# EAGLE design poesp_1.1 (EAGLE 7.7.0)
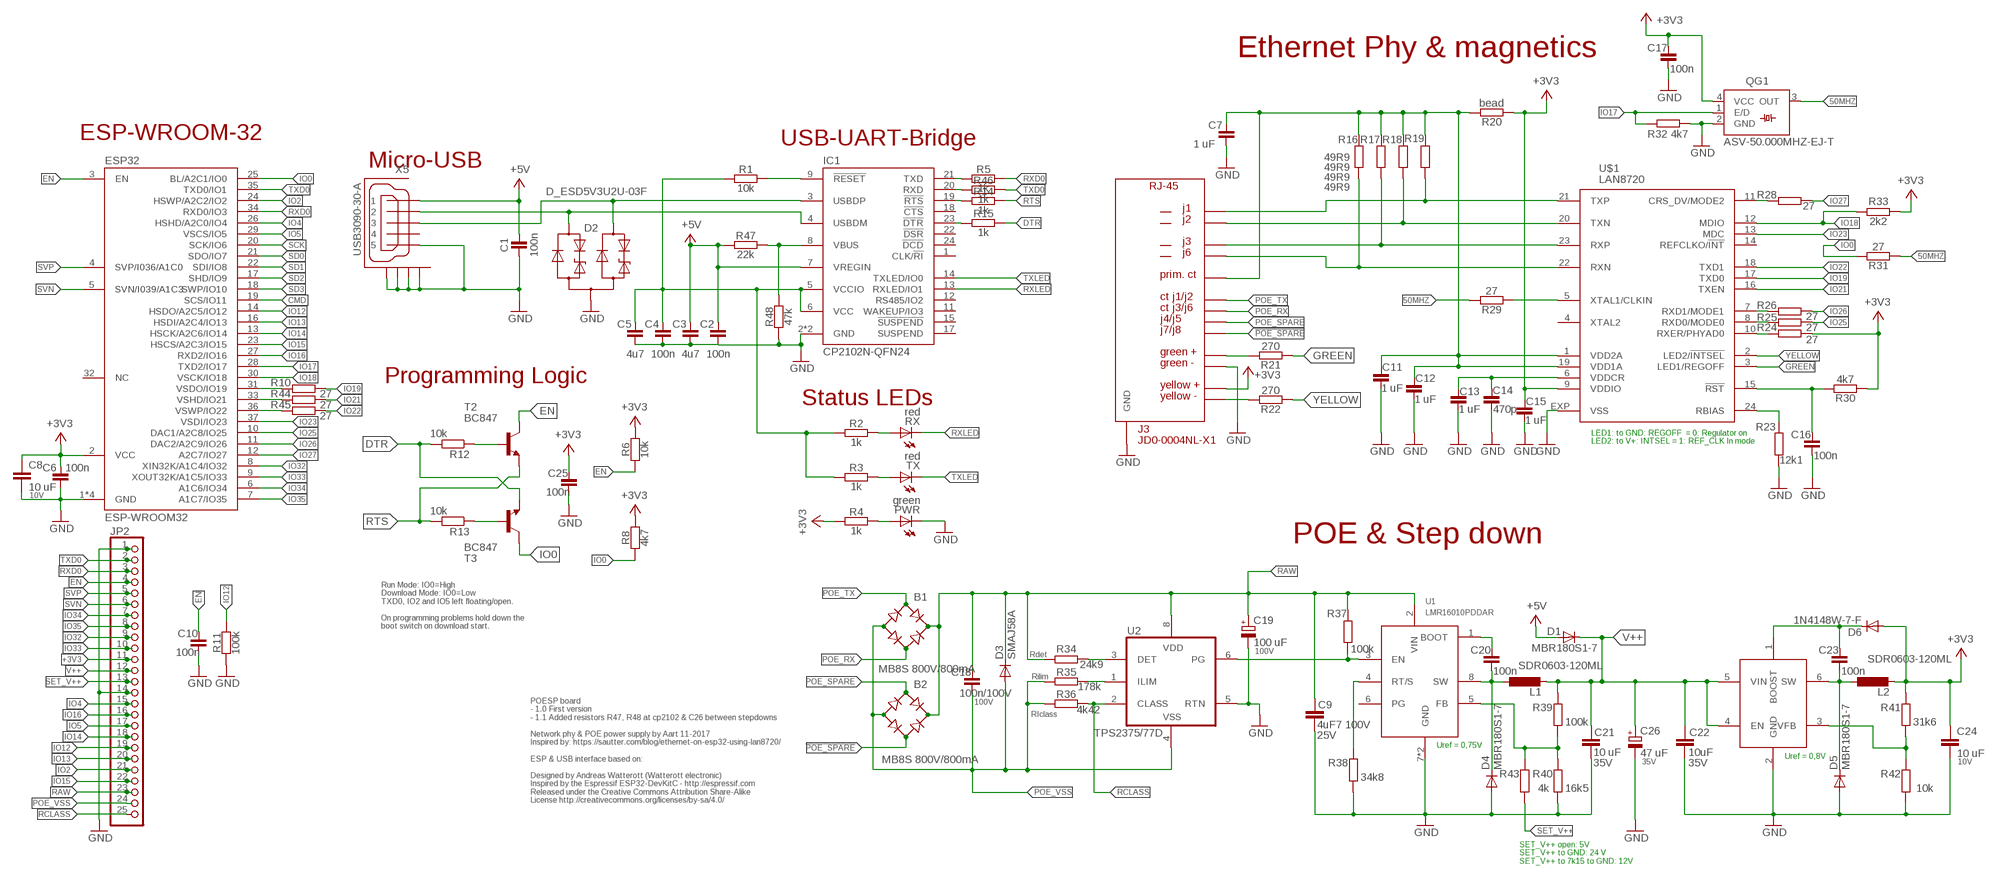
[diagram p0: schematic, sheet 1]

## Parts
B1  MB8S 800V/800mA  B10S  [MBS]
B2  MB8S 800V/800mA  B10S  [MBS]
C1  100n  CAPACITOR-0603  [C0603]
C2  100n  CAPACITOR-0603  [C0603]
C3  4u7  CAPACITOR-0805  [C0805]
C4  100n  CAPACITOR-0603  [C0603]
C5  4u7  CAPACITOR-0805  [C0805]
C6  100n  CAPACITOR-0603  [C0603]
C7  1 uF  CAPACITOR-0603  [C0603]
C8  10 uF  C-EUC0805K  [C0805K]
C9  4uF7 100V  C-EUC1210K  [C1210K]
C10  100n  CAPACITOR-0603  [C0603]
C11  1 uF  CAPACITOR-0603  [C0603]
C12  1 uF  CAPACITOR-0603  [C0603]
C13  1 uF  CAPACITOR-0603  [C0603]
C14  470p  CAPACITOR-0603  [C0603]
C15  1 uF  CAPACITOR-0603  [C0603]
C16  100n  CAPACITOR-0603  [C0603]
C17  100n  CAPACITOR-0603  [C0603]
C18  100n/100V  CAPACITOR-0603  [C0603]
C19  100 uF  CPOL-EUE5-10.5  [E5-10,5]
C20  100n  CAPACITOR-0603  [C0603]
C21  10 uF  C-EUC1210K  [C1210K]
C22  10uF  C-EUC1210K  [C1210K]
C23  100n  CAPACITOR-0603  [C0603]
C24  10 uF  C-EUC0805K  [C0805K]
C25  100n  CAPACITOR-0603  [C0603]
C26  47 uF  CPOL-EUE2,5-6E  [E2,5-6E]
D1  MBR180S1-7  CGRM4001-G  [SOD-123_MINI-SMA]
D2  D_ESD5V3U2U-03F  [SOT723]
D3  SMAJ58A  DIODE-DO214AC  [DO214AC]
D4  MBR180S1-7  CGRM4001-G  [SOD-123_MINI-SMA]
D5  MBR180S1-7  CGRM4001-G  [SOD-123_MINI-SMA]
D6  1N4148W-7-F  CGRM4001-G  [SOD-123_MINI-SMA]
ESP32  ESP-WROOM32  [ESP-WROOM32]
IC1  CP2102N-QFN24  [QFN24-PAD]
IC3  MCP16301/H  [SOT23-6]
J3  JD0-0004NL-X1  [JD0]
JP2  PINHD-1X25  [1X25]
L1  SDR0603-120ML  L-EUWE-TPC  [POWER-CHOKE_WE-TPC]
L2  SDR0603-120ML  L-EUWE-TPC  [POWER-CHOKE_WE-TPC]
PWR  green  LED-0603  [C0603]
QG1  ASV-50.000MHZ-EJ-T  SM77H  [SM77H]
R1  10k  RESISTOR-0603  [C0603]
R2  1k  RESISTOR-0603  [C0603]
R3  1k  RESISTOR-0603  [C0603]
R4  1k  RESISTOR-0603  [C0603]
R5  1k  RESISTOR-0603  [C0603]
R6  10k  RESISTOR-0603  [C0603]
R8  4k7  RESISTOR-0603  [C0603]
R10  27  RESISTOR-0603  [C0603]
R11  100k  RESISTOR-0603  [C0603]
R12  10k  R-EU_R0603  [R0603]
R13  10k  R-EU_R0603  [R0603]
R14  1k  RESISTOR-0603  [C0603]
R15  1k  RESISTOR-0603  [C0603]
R16  49R9  RESISTOR-0603  [C0603]
R17  49R9  RESISTOR-0603  [C0603]
R18  49R9  RESISTOR-0603  [C0603]
R19  49R9  RESISTOR-0603  [C0603]
R20  bead  RESISTOR-0603  [C0603]
R21  270  RESISTOR-0603  [C0603]
R22  270  RESISTOR-0603  [C0603]
R23  12k1  RESISTOR-0603  [C0603]
R24  27  RESISTOR-0603  [C0603]
R25  27  RESISTOR-0603  [C0603]
R26  27  RESISTOR-0603  [C0603]
R28  27  RESISTOR-0603  [C0603]
R29  27  RESISTOR-0603  [C0603]
R30  4k7  RESISTOR-0603  [C0603]
R31  27  RESISTOR-0603  [C0603]
R32  4k7  RESISTOR-0603  [C0603]
R33  2k2  RESISTOR-0603  [C0603]
R34  24k9  RESISTOR-0603  [C0603]
R35  178k  RESISTOR-0603  [C0603]
R36  4k42  RESISTOR-0603  [C0603]
R37  100k  RESISTOR-0603  [C0603]
R38  34k8  RESISTOR-0603  [C0603]
R39  100k  RESISTOR-0603  [C0603]
R40  16k5  RESISTOR-0603  [C0603]
R41  31k6  RESISTOR-0603  [C0603]
R42  10k  RESISTOR-0603  [C0603]
R43  4k  RESISTOR-0603  [C0603]
R44  27  RESISTOR-0603  [C0603]
R45  27  RESISTOR-0603  [C0603]
R46  1k  RESISTOR-0603  [C0603]
R47  22k  RESISTOR-0603  [C0603]
R48  47k  RESISTOR-0603  [C0603]
RX  red  LED-0603  [C0603]
T2  BC847  [SOT23]
T3  BC847  [SOT23]
TX  red  LED-0603  [C0603]
U1  LMR16010PDDAR  [HSOIC8]
U2  TPS2375/77D  [SO08]
U$1  LAN8720  [QFN24]
X5  USB3090-30-A  [USB3090-30-A]

## Nets
50MHZ: QG1.3(OUT) R29.2 R31.1
!POE_SPARE: B2.AC2 J3.P$8
+3V3: C6.2 C8.1 C15.2 C17.2 C24.1 C25.2 D6.A ESP32.2(VCC) J3.P$14 JP2.11 L2.2 QG1.4(VCC) R4.1 R6.2 R8.2 R20.1 R24.1 R30.1 R33.1 R41.1 U$1.9(VDDIO)
+5V: C1.2 C2.2 C3.2 D1.A IC1.7(VREGIN) R47.1 X5.1
CMD: ESP32.19(SCS/IO11)
CPDTR: IC1.23(!DTR) R15.1
CPRTS: IC1.19(!RTS) R14.1
CPTX: IC1.21(TXD) R5.1
D_N: D2.1(C1) IC1.4(USBDM) X5.2
D_P: D2.2(C2) IC1.3(USBDP) X5.3
DTR: R12.2 R15.2 T3.2(E)
EN: C10.2 ESP32.3(EN) JP2.4 R6.1 T2.3(C)
GND: C1.1 C2.1 C3.1 C4.1 C5.1 C6.1 C7.1 C8.2 C9.2 C10.1 C11.1 C12.1 C13.1 C14.1 C15.1 C16.1 C17.1 C19.- C21.2 C22.2 C24.2 C25.1 C26.- D2.3(A) D4.A D5.A ESP32.1(GND) ESP32.15(GND) ESP32.38(GND) ESP32.TP(GND) IC1.2(GND) IC1.TP(GND) IC3.2(GND) J3.P$11 J3.P$21(GND) J3.P$22(GND) J3.P$23(GND) J3.P$24(GND) JP2.1 JP2.14 PWR.C QG1.2(GND) R11.1 R23.1 R32.1 R38.2 R40.2 R42.2 R48.1 U1.7(GND) U1.P$9(GND) U2.5(RTN) U$1.EXP(VSS) X5.5 X5.GND2(GND1) X5.GND3(GND2) X5.P$1(GND3) X5.P$2(GND4)
GREEN: R21.1 U$1.3(LED1/REGOFF)
IO0: ESP32.25(BL/A2C1/IO0) R8.1 R31.2 T3.3(C)
IO2: ESP32.24(HSWP/A2C2/IO2) JP2.21
IO4: ESP32.26(HSHD/A2C0/IO4) JP2.15
IO5: ESP32.29(VSCS/IO5) JP2.17
IO12: ESP32.14(HSDO/A2C5/IO12) JP2.19 R11.2
IO13: ESP32.16(HSDI/A2C4/IO13) JP2.20
IO14: ESP32.13(HSCK/A2C6/IO14) JP2.18
IO15: ESP32.23(HSCS/A2C3/IO15) JP2.22
IO16: ESP32.27(RXD2/IO16) JP2.16
IO17: ESP32.28(TXD2/IO17) QG1.1(E/D) R32.2
IO18: ESP32.30(VSCK/IO18) R33.2 U$1.12(MDIO)
IO19: R10.1 U$1.17(TXD0)
IO21: R44.1 U$1.16(TXEN)
IO22: R45.1 U$1.18(TXD1)
IO23: ESP32.37(VSDI/IO23) U$1.13(MDC)
IO25: ESP32.10(DAC1/A2C8/IO25) R25.1
IO26: ESP32.11(DAC2/A2C9/IO26) R26.1
IO27: ESP32.12(A2C7/IO27) R28.1
IO32: ESP32.8(XIN32K/A1C4/IO32) JP2.9
IO33: ESP32.9(XOUT32K/A1C5/IO33) JP2.10
IO34: ESP32.6(A1C6/IO34) JP2.7
IO35: ESP32.7(A1C7/IO35) JP2.8
N$4: J3.P$1 R19.1 U$1.21(TXP)
N$6: J3.P$2 R18.1 U$1.20(TXN)
N$9: J3.P$3 R17.1 U$1.23(RXP)
N$12: J3.P$5 R16.1 U$1.22(RXN)
N$13: C7.2 C11.2 C12.2 J3.P$4 R16.2 R17.2 R18.2 R19.2 R20.2 U$1.1(VDD2A) U$1.19(VDD1A)
N$14: R23.2 U$1.24(RBIAS)
N$15: C16.2 R30.2 U$1.15(!RST)
N$16: C13.2 C14.2 U$1.6(VDDCR)
N$17: J3.P$12 R21.2
N$18: IC1.8(VBUS) R47.2 R48.2
N$19: J3.P$13 R22.2
N$20: R38.1 U1.4(RT/S)
N$21: R28.2 U$1.11(CRS_DV/MODE2)
N$22: R26.2 U$1.7(RXD1/MODE1)
N$23: R24.2 U$1.10(RXER/PHYAD0)
N$25: R34.1 U2.3(DET)
N$26: R35.1 U2.1(ILIM)
N$27: R25.2 U$1.8(RXD0/MODE0)
N$28: R29.1 U$1.5(XTAL1/CLKIN)
N$29: C4.2 C5.2 IC1.5(VCCIO) IC1.6(VCC) R1.1 R2.1 R3.1
N$30: C20.2 U1.1(BOOT)
N$31: C20.1 D4.C L1.1 U1.8(SW)
N$32: R37.2 U1.3(EN) U2.6(PG)
N$33: R13.1 T3.1(B)
N$34: C23.1 D5.C IC3.6(SW) L2.1
N$35: R39.2 R40.1 R43.1 U1.5(FB)
N$36: R12.1 T2.1(B)
N$37: ESP32.31(VSDO/IO19) R10.2
N$38: ESP32.33(VSHD/IO21) R44.2
N$39: IC3.3(VFB) R41.2 R42.1
N$40: ESP32.36(VSWP/IO22) R45.2
N$41: IC1.20(RXD) R46.1
N$42: C23.2 D6.C IC3.1(BOOST)
POE_RX: B1.AC2 J3.P$10
POE_SPARE: B2.AC1 J3.P$7
POE_TX: B1.AC1 J3.P$9
POE_VSS: B1.- B2.- C18.1 D3.A JP2.24 R35.2 R36.2 U2.4(VSS)
PWR-LED: PWR.A R4.2
RAW: B1.+ B2.+ C9.1 C18.2 C19.+ D3.C JP2.23 R34.2 R37.1 U1.2(VIN) U2.8(VDD)
RCLASS: JP2.25 R36.1 U2.2(CLASS)
RESET: IC1.9(!RESET) R1.2
RTS: R13.2 R14.2 T2.2(E)
RX-LED: R2.2 RX.A
RXD0: ESP32.34(RXD0/IO3) JP2.3 R5.2
RXLED: IC1.13(RXLED/IO1) RX.C
SCK: ESP32.20(SCK/IO6)
SD0: ESP32.21(SDO/IO7)
SD1: ESP32.22(SDI/IO8)
SD2: ESP32.17(SHD/IO9)
SD3: ESP32.18(SWP/IO10)
SET_V++: JP2.13 R43.2
SVN: ESP32.5(SVN/I039/A1C3) JP2.6
SVP: ESP32.4(SVP/I036/A1C0) JP2.5
TX-LED: R3.2 TX.A
TXD0: ESP32.35(TXD0/IO1) JP2.2 R46.2
TXLED: IC1.14(TXLED/IO0) TX.C
V++: C21.1 C22.1 C26.+ D1.C IC3.4(EN) IC3.5(VIN) JP2.12 L1.2 R39.1
YELLOW: R22.1 U$1.2(LED2/!INTSEL)
Unconnected: ESP32.32(NC) IC1.1(CLK/!RI) IC1.11(WAKEUP/IO3) IC1.12(RS485/IO2) IC1.15(!SUSPEND) IC1.17(SUSPEND) IC1.18(!CTS) IC1.22(!DSR) IC1.24(!DCD) U1.6(PG) U$1.4(XTAL2) U$1.14(REFCLKO/!INT) X5.4

## Notes on the sheet
- Ethernet Phy & magnetics
- ESP-WROOM-32 | USB-UART-Bridge
- Micro-USB
- Programming Logic
- Status LEDs
- LED1: to GND: REGOFF  = 0: Regulator on
  LED2: to V+: INTSEL = 1: REF_CLK In mode
- POE & Step down
- Run Mode: IO0=High
  Download Mode: IO0=Low
  TXD0, IO2 and IO5 left floating/open.
  
  On programming problems hold down the 
  boot switch on download start.
- POESP board
  - 1.0 First version
  - 1.1 Added resistors R47, R48 at cp2102 & C26 between stepdowns
  
  Network phy & POE power supply by Aart 11-2017
  Inspired by: https://sautter.com/blog/ethernet-on-esp32-using-lan8720/
  
  ESP & USB interface based on: 
  
  Designed by Andreas Watterott (Watterott electronic)
  Inspired by the Espressif ESP32-DevKitC - http://espressif.com
  Released under the Creative Commons Attribution Share-Alike
  License http://creativecommons.org/licenses/by-sa/4.0/
- Uref = 0,75V
- Uref = 0,8V
- SET_V++ open: 5V 
  SET_V++ to GND: 24 V 
  SET_V++ to 7k15 to GND: 12V

## Library data of the parts
B1 B2 = rectifier:B*S: Surface Mount Glass Passivated Bridge Rectifiers Source: Comchip Bridge Rectifiers B05S-G_B10S-G.pdf
C1-C7 C10-C17 C20 C23 C25 = we-rcl:CAPACITOR: Capacitors ...2.2uF @ 6.3V -> 0402 ...4.7uF @ 6.3V -> 0603 ...10uF @ 16V -> 0805 ...22uF @ 25V -> 1206
C8 C24 = rcl:C-EU: CAPACITOR, European symbol; TYPE: 77-VJ0805G106KXQTBC; VOLTAGE: 10V
C9 = rcl:C-EU: CAPACITOR, European symbol; TYPE: GRM32ER61E226ME15L; VOLTAGE: 25V
C18 = we-rcl:CAPACITOR: Capacitors ...2.2uF @ 6.3V -> 0402 ...4.7uF @ 6.3V -> 0603 ...10uF @ 16V -> 0805 ...22uF @ 25V -> 1206; VOLTAGE: 100V
C19 = rcl:CPOL-EU: POLARIZED CAPACITOR, European symbol; TYPE: CKH/CKE; VOLTAGE: 100V
C21 C22 = rcl:C-EU: CAPACITOR, European symbol; TYPE: GRM32ER61E226ME15L; VOLTAGE: 35V
C26 = rcl:CPOL-EU: POLARIZED CAPACITOR, European symbol; TYPE: CKH/CKE; VOLTAGE: 35V
D1 D4-D6 = diode:CGRM400*-G: Molded plasitc,JEDEC SOD-123/Mini SMA Source: Comchip CGRM4001-G.pdf
D2 = we-rcl:D_ESD5V3U2U: TVS Diode - Uni-directional Ultra Low ESD / Transient Protection Diode Vrwm=5.3V, 0.4pF@1MHz; DIGIKEY: ESD5V3U2U-03F H6327DKR-ND
D3 = diode:DIODE-: DIODE
ESP32 = we-chip:ESP-WROOM32: Espressif ESP-WROOM-32 ESP32 WiFi/WLAN + Bluetooth/BLE Module Compatible with AI-Thinker ESP-32S Module.
IC1 = we-chip:CP2102N: Silabs CP2102N USB to UART Bridge (5V tolerant inputs) CP2102N-QFN24 is pin-compatible with CP2104.
IC3 = MCP16301:MCP16301/H: High-Voltage Input Integrated Switch Step-Down Regulator
J3 = con-pulse:JD0-0004NL-X1: http://www.mouser.com/ds/2/336/-610985.pdf
JP2 = pinhead:PINHD-1X25: PIN HEADER
L1 L2 = rcl:L-EU: INDUCTOR, European symbol
PWR RX TX = we-opto:LED: LEDs red, green, blue -> 0603
QG1 = crystal:SM77H: 3.3V CMOS Clock Oscillator Source: www.pletronics.com .. sm77h%203.3v.pdf; OC_FARNELL: unknown; OC_NEWARK: unknown
R1-R6 R8 R10 R11 R14-R26 R28-R33 R37 R44-R48 = we-rcl:RESISTOR: Resistors all kinds in 0402 and 0603
R12 R13 = resistor:R-EU_: RESISTOR, European symbol
R34 R38-R43 = we-rcl:RESISTOR: Resistors all kinds in 0402 and 0603; FUNCTION: Rdet
R35 = we-rcl:RESISTOR: Resistors all kinds in 0402 and 0603; FUNCTION: Rilim
R36 = we-rcl:RESISTOR: Resistors all kinds in 0402 and 0603; FUNCTION: RIclass
T2 T3 = transistor:BC847: NPN TRANSISTOR
U1 = texas:LMR16010PDDAR: LMR16010PDDAR
U2 = texas_2:TPS2375/77: PoE POWERED DEVICE CONTROLLER
U$1 = microchip-smsc-lan8720:LAN8720: LAN8720A/LAN8720Ai Small Footprint RMII 10/100 Ethernet PHY Transceiver with HP Auto-MDIX Support from SMSC / Microchip <http://www.microchip.com>. (C) 2014 Tomasz Boleslaw CEDRO, cederom@tlen.pl, http://www.tomek.cedro.info. Version 0.1 (2014-01-04): Initial release.
X5 = Alarmding_SIM808:USB3090-30-A

## Board
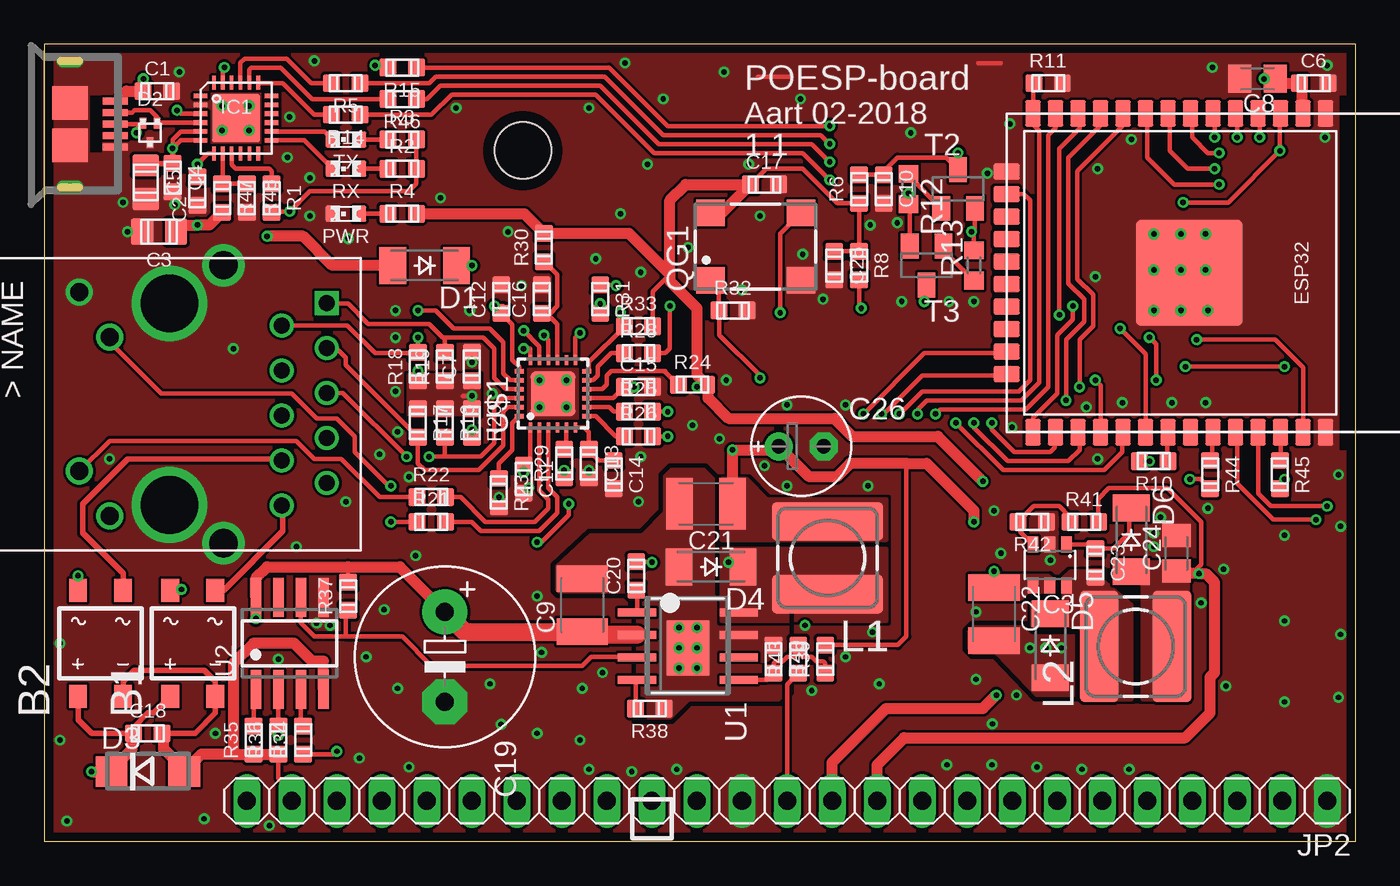
[diagram p1: board, top side]
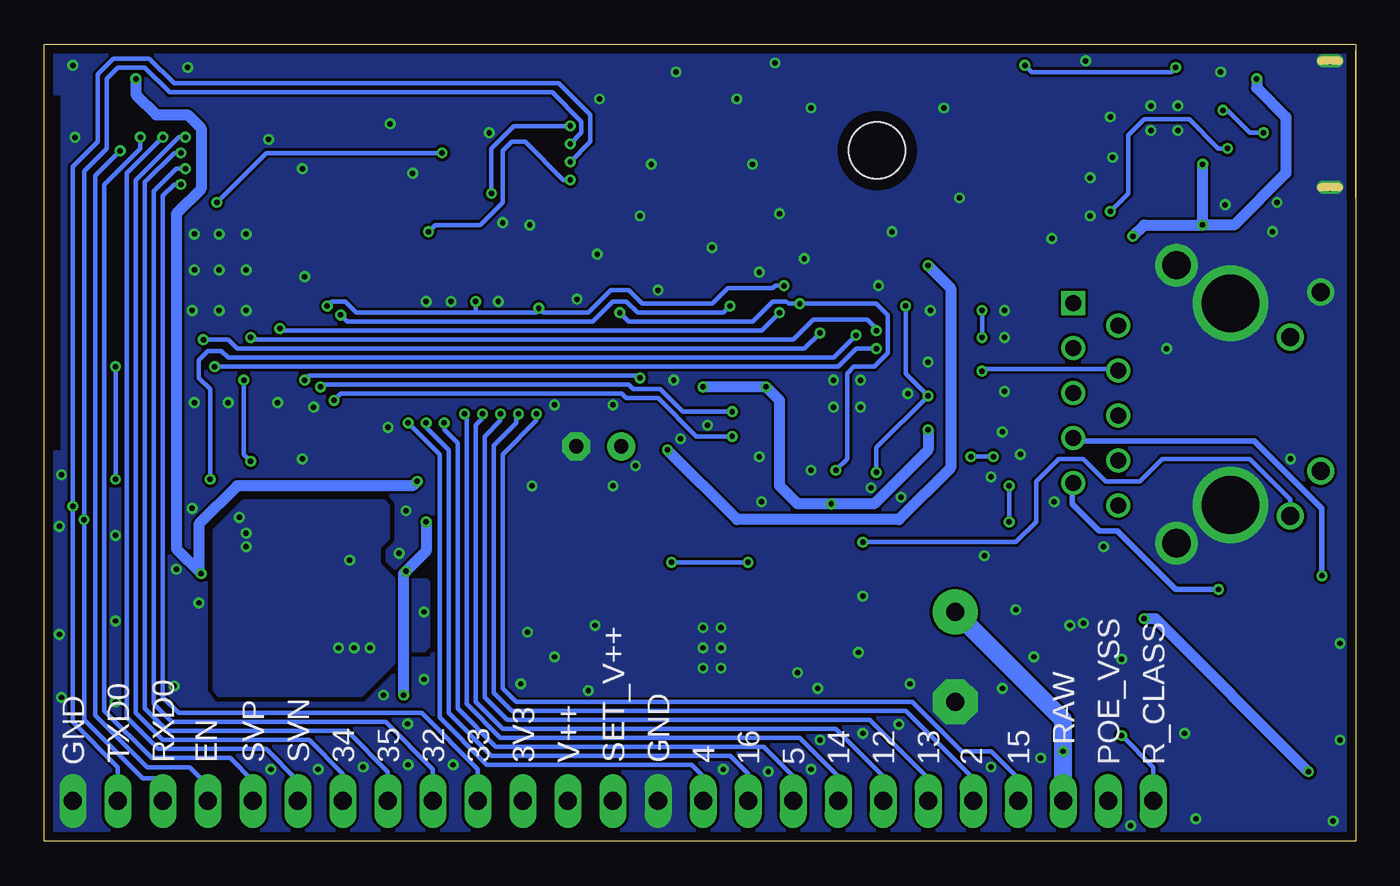
[diagram p2: board, bottom side, seen from below]

Size 74 x 45 mm. Coordinates in mm from the lower left corner, seen from the top.
Outline: 0,0 74,0 74,45 0,45 0,0
Copper layers (1*16): Top 0.035mm / dielectric 1.6mm / Bottom 0.035mm
Design rules "Elecrow_2-layer_PCB_eagle_rule *": minimum track width 6mil, minimum drill 12mil, track to track 6mil, track to pad 8mil, pad to pad 12mil, via to via 12mil, smd to smd 0mil, copper to edge 20mil, drill to drill 10mil, minimum pad ring 6mil, minimum via ring 6mil, stop-mask expansion 0mil, vias tented up to drill 100mil, thermal gap 10mil
Holes 3.2 mm at 27,39
tRestrict: area 24.8,36.8 to 29.2,41.2; 29 lines
bRestrict: area 24.8,36.8 to 29.2,41.2; 17 lines

### Footprints (pad centres in the part's own frame; a part is rotated, then mirrored left to right if it is on the bottom)
MBS = smd 1 x 1.3: + -1.27,-3; - 1.27,-3; AC1 -1.27,3; AC2 1.27,3
C0603 = smd 1 x 0.95: 1 0,0.8; 2 0,-0.8
C0805 = smd 1.5 x 1.25: 1 0,0.95; 2 0,-0.95
C0805K = smd 1.3 x 1.6: 1 -1,0; 2 1,0
C1210K = smd 1.5 x 2.9: 1 -1.5,0; 2 1.5,0
E5-10,5 = drill 1.016 pad 2.54: + -2.54,0 | drill 1.016 pad 2.54 octagon: - 2.54,0
E2,5-6E = drill 0.813 pad 1.575: + -1.27,0 | drill 0.813 pad 1.575 octagon: - 1.27,0
SOD-123_MINI-SMA = smd 1.5 x 2.1: A 1.8,0; C -1.8,0
SOT723 = smd 0.6 x 0.4: 1 -0.55,0.4; 2 -0.55,-0.4; 3 0.55,0
DO214AC = smd 1.8 x 1.7: A 2.05,0; C -2.05,0
ESP-WROOM32 = smd 1.5 x 0.9: 1 -9,7; 2 -9,5.73; 3 -9,4.46; 4 -9,3.19; 5 -9,1.92; 6 -9,0.65; 7 -9,-0.62; 8 -9,-1.89; 9 -9,-3.16; 10 -9,-4.43; 11 -9,-5.7; 12 -9,-6.97; 13 -9,-8.24; 14 -9,-9.51; 25 9,-9.51; 26 9,-8.24; 27 9,-6.97; 28 9,-5.7; 29 9,-4.43; 30 9,-3.16; 31 9,-1.89; 32 9,-0.62; 33 9,0.65; 34 9,1.92; 35 9,3.19; 36 9,4.46; 37 9,5.73; 38 9,7 | smd 0.9 x 1.5: 15 -5.715,-11; 16 -4.445,-11; 17 -3.175,-11; 18 -1.905,-11; 19 -0.635,-11; 20 0.635,-11; 21 1.905,-11; 22 3.175,-11; 23 4.445,-11; 24 5.715,-11 | smd 6 x 6: TP 0,-0.7
QFN24-PAD = smd 0.8 x 0.26: 1 -2,1.25; 2 -2,0.75; 3 -2,0.25; 4 -2,-0.25; 5 -2,-0.75; 6 -2,-1.25; 13 2,-1.25; 14 2,-0.75; 15 2,-0.25; 16 2,0.25; 17 2,0.75; 18 2,1.25 | smd 0.26 x 0.8: 7 -1.25,-2; 8 -0.75,-2; 9 -0.25,-2; 10 0.25,-2; 11 0.75,-2; 12 1.25,-2; 19 1.25,2; 20 0.75,2; 21 0.25,2; 22 -0.25,2; 23 -0.75,2; 24 -1.25,2 | smd 2.7 x 2.7: TP 0,0
SOT23-6 = smd 0.6 x 0.9: 1 -0.95,-1.15; 2 0,-1.15; 3 0.95,-1.15; 4 0.95,1.15; 5 0,1.15; 6 -0.95,1.15
JD0 = drill 0.9 square: P$1 -5.715,1.27 | drill 0.9: P$2 -4.445,-1.27; P$3 -3.175,1.27; P$4 -1.905,-1.27; P$5 -0.635,1.27; P$6 0.635,-1.27; P$7 1.905,1.27; P$8 3.175,-1.27; P$9 4.445,1.27; P$10 5.715,-1.27 | drill 1.016: P$11 -6.325,-12.7; P$12 -3.785,-10.998; P$13 3.785,-12.7; P$14 6.325,-10.998 | drill 3.251: P$21 5.69,-7.62; P$22 -5.69,-7.62 | drill 1.6: P$23 -7.849,-4.572; P$24 7.849,-4.572
1X25 = drill 1.016 long: 1 -29.21,0; 2 -26.67,0; 3 -24.13,0; 4 -21.59,0; 5 -19.05,0; 6 -16.51,0; 7 -13.97,0; 8 -11.43,0; 9 -8.89,0; 10 -6.35,0; 11 -3.81,0; 12 -1.27,0; 13 1.27,0; 14 3.81,0; 15 6.35,0; 16 8.89,0; 17 11.43,0; 18 13.97,0; 19 16.51,0; 20 19.05,0; 21 21.59,0; 22 24.13,0; 23 26.67,0; 24 29.21,0; 25 31.75,0
POWER-CHOKE_WE-TPC = smd 6.3 x 2.2: 1 0,2.05; 2 0,-2.05
C0603' = smd 0.9 x 0.8: A 0,-0.75; C 0,0.75
SM77H = smd 1.6 x 1.5: 1 -2.55,-1.9; 2 2.55,-1.9; 3 2.55,1.9; 4 -2.55,1.9
R0603 = smd 1 x 1.1: 1 -0.85,0; 2 0.85,0
SOT23 = smd 1 x 1.4: 1 -0.95,-1.1; 2 0.95,-1.1; 3 0,1.1
HSOIC8 = smd 0.45 x 2.15: 1 -2.005,-2.875; 2 -0.735,-2.875; 3 0.535,-2.875; 4 1.805,-2.875; 5 1.805,2.875; 6 0.535,2.875; 7 -0.735,2.875; 8 -2.005,2.875 | smd 3.1 x 2.4: P$9 0,0
SO08 = smd 0.6 x 2.2: 1 -1.905,-2.6; 2 -0.635,-2.6; 3 0.635,-2.6; 4 1.905,-2.6; 5 1.905,2.6; 6 0.635,2.6; 7 -0.635,2.6; 8 -1.905,2.6
QFN24 = smd 0.584 x 0.254: 1 -1.905,1.27; 2 -1.905,0.762; 3 -1.905,0.254; 4 -1.905,-0.254; 5 -1.905,-0.762; 6 -1.905,-1.27; 13 1.905,-1.27; 14 1.905,-0.762; 15 1.905,-0.254; 16 1.905,0.254; 17 1.905,0.762; 18 1.905,1.27 | smd 0.254 x 0.584: 7 -1.27,-1.905; 8 -0.762,-1.905; 9 -0.254,-1.905; 10 0.254,-1.905; 11 0.762,-1.905; 12 1.27,-1.905; 19 1.27,1.905; 20 0.762,1.905; 21 0.254,1.905; 22 -0.254,1.905; 23 -0.762,1.905; 24 -1.27,1.905 | smd 2.54 x 2.54: EXP 0,0
USB3090-30-A = smd 1.4 x 0.4: 1 0,1.3; 2 0,0.65; 3 0,0; 4 0,-0.65; 5 0,-1.3 | smd 2 x 1.9: GND2 -2.55,1.2; GND3 -2.55,-1.2 | drill 0.45 long: P$1 -2.55,-3.575; P$2 -2.55,3.575

### Placement (x,y rotation side)
B1  8.38,11.18 0 top
B2  3.17,11.18 0 top
C1  6.38,42.35 270 top
C2  8.64,36.7 180 top
C3  6.48,34.42 90 top
C4  7.24,37.47 180 top
C5  5.71,37.21 180 top
C6  71.63,42.8 270 top
C7  24.13,26.8 0 top
C8  68.45,43.05 180 top
C9  30.35,13.34 90 top
C10  47.37,36.83 180 top
C11  27.05,20.45 180 top
C12  25.78,30.61 0 top
C13  30.73,21.34 180 top
C14  32.13,20.7 180 top
C15  33.53,25.65 270 top
C16  28.07,30.61 0 top
C17  40.64,37.08 270 top
C18  5.84,6.1 270 top
C19  22.61,10.41 270 top
C20  33.4,14.99 0 top
C21  37.34,19.05 180 top
C22  53.59,12.83 270 top
C23  59.31,15.72 180 top
C24  63.88,16.26 90 top
C25  44.58,32.51 180 top
C26  42.71,22.3 0 top
D1  21.46,32.51 180 top
D2  5.97,40.01 270 top
D3  5.84,3.94 0 top
D4  37.62,15.49 180 top
D5  56.77,11.05 270 top
D6  61.34,17.02 270 top
ESP32  65.3,32.09 270 top
IC1  10.82,40.83 0 top
IC3  56.74,15.6 180 top
J3  14.68,24.68 270 top
JP2  43.18,2.29 180 top
L1  44.2,16 180 top
L2  61.58,10.99 90 top
PWR  green  [C0603']  17.02,35.43 90 top
QG1  40.14,33.58 0 top
R1  12.83,36.32 180 top
R2  20.19,37.97 270 top
R3  20.19,39.62 270 top
R4  20.19,35.43 270 top
R5  17.02,42.8 90 top
R6  45.97,36.83 0 top
R8  45.97,32.51 180 top
R10  62.61,21.46 90 top
R11  56.64,42.8 270 top
R12  48.77,36.83 270 top
R13  52.45,32.51 90 top
R14  17.02,41.02 90 top
R15  20.19,43.69 90 top
R16  22.61,23.62 180 top
R17  21.08,23.62 180 top
R18  21.08,26.8 0 top
R19  22.61,26.8 0 top
R20  24.13,23.62 180 top
R21  21.84,18.03 270 top
R22  21.84,19.43 270 top
R23  25.65,19.68 180 top
R24  36.58,25.78 270 top
R25  33.53,24.26 270 top
R26  33.53,22.86 270 top
R28  33.53,27.56 270 top
R29  29.34,21.34 0 top
R30  28.19,33.53 0 top
R31  31.37,30.61 180 top
R32  38.86,29.97 270 top
R33  33.53,29.08 270 top
R34  14.61,5.71 0 top
R35  11.81,5.71 0 top
R36  13.21,5.71 0 top
R37  17.14,13.84 0 top
R38  34.16,7.49 90 top
R39  44.07,10.29 0 top
R40  41.15,10.29 180 top
R41  58.67,18.03 270 top
R42  55.75,18.03 90 top
R43  42.55,10.29 0 top
R44  65.79,20.7 180 top
R45  69.72,20.7 180 top
R46  20.19,41.91 90 top
R47  10.03,36.32 180 top
R48  11.43,36.32 180 top
RX  red  [C0603']  17.02,37.97 90 top
T2  51.56,36.83 0 top
T3  49.78,32.51 180 top
TX  red  [C0603']  17.02,39.62 90 top
U1  36.32,10.92 270 top
U2  13.84,11.18 0 top
U$1  28.7,25.27 90 top
X5  4,40.5 0 top

### Tracks (layer width: path | path; a pad name or v marks a point on that pad's centre or on a via)
50MHZ  (via drill 0.3)
  Top 0.254: R29.2 v29.34,20.95 | v31.37,30.35 R31.1 | v41.53,29.84 41.53,34.31 QG1.3
  Bottom 0.254: v41.53,29.84 41.02,29.34 34.04,29.34 32.89,30.48 32.13,30.48 32,30.35 v31.37,30.35 27.05,30.35 26.42,29.72 26.42,27.56 27.18,26.8 28.32,26.8 28.7,26.42 28.7,21.59 v29.34,20.95
!POE_SPARE
  Top 0.305: B2.AC2 4.45,15.11 2.16,17.4 | 2.16,17.4 2.16,19.05 | 2.16,19.05 4.7,21.59 13.32,21.59 J3.P$8 | 2.16,17.4 2.16,19.05
+3V3  (via drill 0.3)
  Top 0.254: U$1.9 32.09,25.02 C15.2 v33.27,25.65 | R41.1 59.47,19.34 60.07,19.94 63.37,19.94 65.28,18.03 65.28,15.62 64.77,15.11 64.02,15.11 | 39.58,37.08 C17.2 40.73,37.97 42.8,37.97 44.74,36.03 R6.2 R8.2 C25.2 | R20.1 24.13,22.99 | v27.81,16.89 28.07,16.89 29.59,18.41 v29.59,19.05 | R33.1 34.33,31.03 35.31,32
  Top 0.406: 24.13,22.99 v24.13,23.24
  Top 0.61: JP2.11 46.99,4.32 48.51,5.84 64.39,5.84 65.79,7.24 65.79,9.27 66.04,9.53 66.04,14.61 65.53,15.11 v65.15,15.11 64.02,15.11 C24.1 | v68.83,43.05 68.82,43.04 69.44,43.04 C8.1 69.71,42.8 C6.2 70.99,42.63 70.99,41.13 ESP32.2 | v52.96,20.32 50.42,22.86 45.59,22.86 44.58,23.88 38.61,23.88 37.47,25.02 37.47,25.69 R24.1 | 35.24,32.07 32.98,34.33 R30.1 27.09,35.43 R4.1 | 35.24,32.07 35.31,32 35.31,31.62 36.83,30.1 36.83,26.33 R24.1 | 35.24,32.07 35.31,32.13 35.31,36.2 36.2,37.08 C17.2 38.23,35.48 QG1.4 | v36.83,25.65 37.25,25.65 R24.1
  Bottom 0.254: J3.P$14 3.68,19.3 5.97,21.59 10.92,21.59 12.19,20.32 14.1,20.32 15.37,21.59 16.76,21.59 18.03,20.32 18.03,18.03 19.18,16.89 v27.81,16.89
  Bottom 0.61: v68.83,43.05 68.83,42.16 67.69,41.02 65.91,41.02 65.15,40.26 65.15,36.83 66.55,35.43 66.55,16.51 v65.15,15.11 65.28,15.24 65.28,17.91 63.12,20.07 53.21,20.07 v52.96,20.32 | v36.83,25.65 v33.27,25.65 32.51,24.89 32.51,20.07 31.5,19.05 v29.59,19.05 27.18,19.05 24.13,22.1 v24.13,23.24
  pour Top (no thermals): 61.98,8 64.52,8 64.52,15.75 60.45,15.75 60.45,14.61 61.98,14.61
+5V  (via drill 0.3)
  Top 0.254: v5.58,43.05 v5.59,43.05 | C2.2 v8.64,38.23 9.23,38.83 IC1.7
  Top 0.305: X5.1 4.24,42.04 4.32,42.04
  Top 0.61: 4.32,42.04 4.64,42.35 C1.2 v5.58,43.05 | D1.A 16.26,32.51 14.61,34.16 v12.57,34.16 | C3.2 7.81,34.8 v8.64,34.8 9.31,34.8 R47.1
  Bottom 0.61: v5.59,43.05 5.59,42.55 3.94,40.89 3.94,37.72 6.86,34.8 v8.64,34.8 | 8.64,35.05 v8.64,38.23 v8.64,34.8 | v12.57,34.16 11.94,34.8 v8.64,34.8
CPDTR  (via drill 0.3)
  Top 0.254: IC1.23 10.07,43.6 v10.16,43.69 | v18.67,43.81 19.27,43.81 R15.1
  Bottom 0.254: v10.16,43.69 10.41,43.43 18.29,43.43 v18.67,43.81
CPRTS
  Top 0.254: R14.1 15.24,41.02 13.46,42.8 12.1,42.8 IC1.19
CPTX
  Top 0.254: IC1.21 11.07,43.96 11.3,44.2 13.68,44.2 15.07,42.8 R5.1
D_N
  Top 0.152: 6.39,40.58 D2.1
  Top 0.254: X5.2 4.95,41.15 5.08,41.27 5.97,41.27 6.37,40.88 D2.1 | IC1.4 6.39,40.58
D_P  (via drill 0.3)
  Top 0.152: 5.51,40.5 D2.2
  Top 0.254: X5.3 5.51,40.5 | IC1.3 7.69,41.08 v7.49,41.27 | v5.21,40.01 5.21,40.19 D2.2
  Bottom 0.254: v7.49,41.27 7.24,41.27 5.97,40.01 v5.21,40.01
DTR  (via drill 0.3)
  Top 0.254: R15.2 31.88,43.69 35.18,40.39 v44.32,40.39 | T3.2 48.83,35.91 R12.2 v48.77,36.58
  Bottom 0.254: v44.32,40.39 47.5,40.39 48.77,39.12 v48.77,36.58
EN  (via drill 0.3)
  Top 0.254: ESP32.3 69.72,41.06 v69.72,38.99 66.8,36.07 v64.26,36.07 | R6.1 C10.2 47.37,37.85 48.13,38.61 50.88,38.61 T2.3 v51.56,38.86
  Bottom 0.254: JP2.4 64.77,3.17 65.79,4.19 68.2,4.19 71.12,7.11 71.12,37.59 v69.72,38.99 | v51.56,38.86 61.47,38.86 v64.26,36.07
GND  (via drill 0.3)
  Top 0.254: 40.27,43.18 42.04,43.18 | 52.71,43.94 53.98,43.94
  other vias: 10.67,27.81 25.65,19.43 30.73,20.95 27.94,24.51 29.46,24.51 29.46,26.04 27.94,26.04 25.27,25.27 19.81,25.4 19.81,28.45 26.92,31.37 35.81,10.92 36.83,10.92 36.83,12.06 35.81,12.06 35.81,9.78 36.83,9.78 69.98,17.27 69.98,7.87 69.98,12.45 56.77,15.88 62.61,16.64 57.4,10.92 54.86,8.26 47.12,8.89 46.74,11.81 43.31,8.51 65.28,13.46 66.55,15.37 65.66,18.8 33.66,21.72 31.11,32.89 33.66,32.13 36.32,33.53 40.64,21.21 53.59,18.67 53.98,16.26 36.58,23.5 60.83,24.77 58.8,24.51 54.61,23.37 59.44,21.59 63.63,24.77 65.53,24.77 52.45,30.48 51.05,30.48 48.39,30.48 43.94,30.61 39.37,31.11 42.8,33.15 40.39,35.31 32.51,35.43 22.35,36.32 23.24,41.4 30.73,41.4 34.04,38.23 39.75,38.23 32.77,43.94 34.92,41.91 42.67,41.91 48.9,40.01 54.48,40.51 65.91,43.69 72.39,43.81 72.26,39.75 61.34,39.62 59.44,37.97 59.31,31.88 62.61,29.97 62.61,34.29 65.53,34.29 65.66,29.97 62.61,32.26 64.14,32.26 64.14,34.29 64.14,29.97 65.53,32.26 73.03,20.7 73.15,17.78 73.15,11.68 73.03,8.13 30.35,8.64 31.5,9.53 28.07,10.67 18.16,10.41 27.81,13.84 20.95,16.13 14.22,16.64 17.02,19.18 16.13,12.19 46.61,34.8 48.13,34.92 13.72,38.61 19.81,29.97 24,29.97 24.13,27.05 38.48,26.04 38.1,22.73 53.21,37.72 45.21,10.41 42.93,12.19 52.58,9.14 52.58,12.95 19.18,13.08 55.63,10.92 33.53,19.18 19.94,8.64 17.78,4.7 15.37,12.32 38.35,43.43 9.02,1.27 1.27,1.14 0.89,5.71 0.89,11.18 26.16,34.42 17.14,34.04 10.03,41.53 11.56,41.53 11.56,40.13 10.03,40.13 7.62,43.43 9.65,6.1 3.68,21.59 13.84,40.89 15.24,44.07 56.52,10.92 62.61,17.4 62.99,18.29 41.91,20.07 66.67,8.76 13.21,10.29 12.7,0.89 25.78,6.6 27.81,6.1 30.23,5.71 30.73,4.06 33.15,3.94 20.57,4.19 35.69,4.06 50.93,4.32 53.47,4.32 56.01,4.19 58.55,4.06 61.21,4.06 25.15,8.89 27.35,19.96 53.5,6.63 18.92,21.84 20.57,20.57 19.94,23.11 46.48,20.07 14.99,37.47 14.99,35.31 4.7,34.42 4.45,36.07 7.37,35.94 41.91,24.64 45.21,24.64
  pour Bottom (rank 3, no thermals): -0.64,-0.51 -0.64,45.47 74.8,45.47 74.8,-0.51
  pour Top (rank 4, no thermals): -0.25,-0.25 -0.25,45.21 74.17,45.21 74.17,-0.25
GREEN
  Top 0.254: R21.1 24.13,18.03 24.64,17.53 27.94,17.53 28.96,18.54 28.96,19.43 28.45,19.94 U$1.3
IO0  (via drill 0.3)
  Top 0.254: R31.2 32.22,31.41 v32.26,31.37 | ESP32.25 55.79,23.91 57.15,25.27 57.15,28.57 58.04,29.46 v58.04,30.23 | 49.48,31.71 T3.3 49.66,31.29 v49.66,30.48 | R8.1 45.97,30.23 v46.1,30.1
  Bottom 0.254: v32.26,31.37 32.77,31.37 32.89,31.24 35.43,31.24 36.32,30.35 40.26,30.35 41.02,31.11 42.04,31.11 43.31,29.84 45.85,29.84 v46.1,30.1 46.1,29.97 46.23,29.84 49.53,29.84 | v58.04,30.23 57.78,30.48 57.02,30.48 56.39,29.84 49.53,29.84 | v49.66,30.48 49.66,29.97 49.53,29.84
IO2  (via drill 0.3)
  Top 0.254: v47.24,24.13 47.37,24.13 49.53,26.29 54.21,26.29 ESP32.24
  Bottom 0.254: v47.24,24.13 47.37,24 47.37,23.62 48.64,22.35 48.64,8.38 47.62,7.37 25.4,7.37 21.59,3.56 JP2.21
IO4  (via drill 0.3)
  Top 0.254: v53.47,23.62 53.47,23.24 54.74,21.97 56.77,21.97 57.02,22.23 57.02,23.06 ESP32.26
  Bottom 0.254: v53.47,23.62 51.69,21.84 51.69,6.99 49.02,4.32 37.47,4.32 36.83,3.68 JP2.15
IO5  (via drill 0.3)
  Top 0.254: v51.44,23.62 54.1,20.95 59.82,20.95 60.83,21.97 60.83,23.06 ESP32.29
  Bottom 0.254: v51.44,23.62 51.44,23.24 50.67,22.48 50.67,7.49 48.51,5.33 33.4,5.33 31.75,3.68 JP2.17
IO12  (via drill 0.3)
  Top 0.254: v49.28,24.13 49.28,24.38 49.78,24.89 55.12,24.89 56.13,25.91 56.13,40.13 55.79,40.47 ESP32.14 55.79,42.75 R11.2
  Bottom 0.254: v49.28,24.13 49.28,23.88 49.66,23.5 49.66,7.87 48.13,6.35 29.34,6.35 26.67,3.68 JP2.19
IO13  (via drill 0.3)
  Top 0.254: ESP32.16 55.28,36.54 55.63,36.2 55.63,26.04 54.99,25.4 49.53,25.4 v48.26,24.13
  Bottom 0.254: v48.26,24.13 48.26,23.75 49.15,22.86 49.15,8.13 47.88,6.86 27.43,6.86 24.13,3.56 JP2.20
IO14  (via drill 0.3)
  Top 0.254: ESP32.13 57.06,40.3 56.64,39.88 56.64,25.65 55.37,24.38 50.55,24.38 v50.29,24.13
  Bottom 0.254: v50.29,24.13 50.16,24 50.16,7.75 48.26,5.84 31.37,5.84 29.21,3.68 JP2.18
IO15  (via drill 0.3)
  Top 0.254: v46.23,24.13 49.66,27.56 54.21,27.56 ESP32.23
  Bottom 0.254: v46.23,24.13 46.23,23.75 48.13,21.84 48.13,8.64 47.37,7.87 25.02,7.87 22.23,5.08 20.57,5.08 19.05,3.56 JP2.22
IO16  (via drill 0.3)
  Top 0.254: v52.45,23.62 52.45,23.37 54.36,21.46 57.78,21.46 58.42,22.1 58.42,23.01 ESP32.27
  Bottom 0.254: v52.45,23.62 52.45,23.37 51.18,22.1 51.18,7.24 48.77,4.83 35.31,4.83 34.29,3.81 JP2.16
IO17  (via drill 0.3)
  Top 0.254: ESP32.28 59.6,25.74 v59.31,26.04 | v40.39,26.16 40.39,26.29 38.1,28.57 38.1,29.93 R32.2 38.06,31.59 37.68,31.59 QG1.1
  Bottom 0.254: v59.31,26.04 59.05,26.29 40.51,26.29 v40.39,26.16
IO18  (via drill 0.3)
  Top 0.254: U$1.12 30.73,26.67 30.73,27.05 32.73,29.05 R33.2 32.51,29.3 v32.51,29.84 | ESP32.30 62.14,27.52 v60.71,28.96
  Bottom 0.254: v60.71,28.96 60.58,28.83 33.53,28.83 v32.51,29.84
IO19  (via drill 0.3)
  Top 0.254: U$1.17 27.94,27.94 v27.05,28.83 | R10.1 v62.36,21.46 | v62.74,26.04 62.74,28.07 v62.36,28.45
  Bottom 0.254: v27.05,28.83 27.05,28.96 27.56,29.46 30.61,29.46 31.75,28.32 62.23,28.32 v62.36,28.45 | v62.36,21.46 62.74,21.84 v62.74,26.04
IO21  (via drill 0.3)
  Top 0.254: v28.19,28.57 28.45,28.32 U$1.16 | v64.64,20.45 65.28,20.45 65.28,20.41 R44.1
  Bottom 0.254: v28.19,28.57 29.46,27.3 63.63,27.3 64.01,27.69 64.77,27.69 65.28,27.18 65.28,26.16 64.64,25.53 v64.64,20.45
IO22  (via drill 0.3)
  Top 0.254: v69.98,26.8 v64.39,26.8 | v27.05,27.81 27.43,27.81 U$1.18 | R45.1 69.72,20.19 v69.98,20.45
  Bottom 0.254: v69.98,26.8 v69.98,20.45 | v27.05,27.81 28.19,27.81 29.21,26.8 v64.39,26.8
IO23  (via drill 0.3)
  Top 0.254: ESP32.37 71.03,26.76 69.47,28.32 v65.02,28.32 | v30.23,28.7 29.97,28.45 U$1.13
  Bottom 0.254: v65.02,28.32 63.63,28.32 63.12,27.81 31.11,27.81 v30.23,28.7
IO25  (via drill 0.3)
  Top 0.254: R25.1 v35.18,24.26 | v58.42,25.65 58.42,28.32 59.18,29.08 59.18,30.86 58.29,31.75 58.29,37.85 60.83,40.39 60.83,41.06 ESP32.10
  Bottom 0.254: v35.18,24.26 37.97,24.26 39.24,25.53 40.77,25.53 41.02,25.78 58.29,25.78 v58.42,25.65
IO26  (via drill 0.3)
  Top 0.254: R26.1 v35.18,22.86 | v57.66,24.89 57.66,28.32 58.67,29.34 58.67,30.61 57.78,31.5 57.78,38.61 59.56,40.39 59.56,41.06 ESP32.11
  Bottom 0.254: v35.18,22.86 37.21,22.86 39.37,25.02 41.15,25.02 41.4,25.27 57.28,25.27 v57.66,24.89
IO27  (via drill 0.3)
  Top 0.254: R28.1 35.05,27.56 35.31,27.81 v35.31,30.23 | v57.28,29.72 57.28,39.12 58.42,40.26 58.42,41.01 ESP32.12
  Bottom 0.254: v35.31,30.23 35.69,29.84 40.51,29.84 41.15,30.48 41.91,30.48 43.05,29.34 56.9,29.34 v57.28,29.72
IO32  (via drill 0.3)
  Top 0.254: v66.04,37.97 64.52,37.97 63.5,38.99 63.5,41.01 ESP32.8
  Bottom 0.254: JP2.9 52.07,4.06 54.74,6.73 66.8,6.73 67.82,7.75 67.82,36.7 66.55,37.97 v66.04,37.97
IO33  (via drill 0.3)
  Top 0.254: v66.29,37.08 63.75,37.08 62.23,38.61 62.23,41.01 ESP32.9
  Bottom 0.254: JP2.10 49.53,4.06 52.7,7.24 66.42,7.24 67.31,8.13 67.31,36.45 66.67,37.08 v66.29,37.08
IO34  (via drill 0.3)
  Top 0.254: v66.04,39.75 66.04,41.01 ESP32.6
  Bottom 0.254: JP2.7 57.15,3.81 59.05,5.71 67.31,5.71 68.83,7.24 68.83,37.34 66.42,39.75 v66.04,39.75
IO35  (via drill 0.3)
  Top 0.254: v66.29,38.86 65.66,38.86 64.77,39.75 64.77,41.01 ESP32.7
  Bottom 0.254: JP2.8 54.61,3.94 56.9,6.22 67.06,6.22 68.33,7.49 68.33,37.21 66.67,38.86 v66.29,38.86
N$4
  Top 0.254: 22.61,28.45 24.77,28.45 25.4,27.81 25.4,26.16 26.04,25.53 U$1.21 | R19.1 22.61,28.45 | 22.61,28.45 22.48,28.45 21.72,29.21 18.29,29.21 17.14,30.35 15.99,30.35 J3.P$1
N$6  (via drill 0.3)
  Top 0.254: 20.96,27.47 R18.1 | U$1.20 26.29,26.04 25.91,26.42 25.91,28.19 25.15,28.96 23.11,28.96 22.1,29.97 v21.08,29.97 | J3.P$2 17.1,29.12 18.67,27.56 21.04,27.56 R18.1 | R18.1 v21.08,28.45
  Bottom 0.254: v21.08,28.45 v21.08,29.97
N$9
  Top 0.254: U$1.23 26.16,24.51 25.91,24.26 25.91,22.35 24.51,20.95 21.46,20.95 21.08,21.34 R17.1 | 20.83,22.48 21.04,22.48 21.04,22.78 R17.1 | J3.P$3 16.47,27.86 17.02,27.3 17.02,26.89 R17.1
N$12  (via drill 0.3)
  Top 0.254: R16.1 22.61,21.72 | 22.61,21.72 24.64,21.72 25.4,22.48 25.4,24.51 25.91,25.02 U$1.22 | 22.61,21.72 v21.72,21.72 | J3.P$5 16.85,25.32 v20.45,21.72
  Bottom 0.254: v21.72,21.72 v20.45,21.72
N$13  (via drill 0.3)
  Top 0.254: v21.08,26.54 R18.2 | v25.4,30.23 25.91,30.23 25.91,29.72 25.87,29.72 C12.2 26.42,29.17 26.42,27.18 26.8,26.8 U$1.19 | v24.13,25.15 23.62,25.15 | v27.05,20.83 C11.2 27.43,20.87 U$1.1
  Bottom 0.254: J3.P$4 13.49,26.67 20.95,26.67 v21.08,26.54 | v25.4,30.23 25.4,26.42 v24.13,25.15 27.05,22.23 v27.05,20.83
  pour Top (no thermals): 20.57,26.29 24.51,26.29 24.51,24.13 20.57,24.13
N$14
  Top 0.254: R23.2 25.65,21.34 26.42,22.1 26.42,23.62 U$1.24
N$15
  Top 0.254: R30.2 28.23,32.73 28.96,32 28.96,30.23 28.54,29.81 28.36,29.81 | C16.2 28.36,29.81 | 28.36,29.81 28.96,29.21 U$1.15
N$16
  Top 0.254: U$1.6 30.48,23.37 30.73,23.11 C13.2 30.73,22.05 31.28,21.5 C14.2
N$17  (via drill 0.3)
  Top 0.254: v19.56,18.03 R21.2 | v19.56,20.07 19.43,20.07 17.53,21.97 17.53,22.86 16.51,23.88 15.37,23.88 13.97,25.27 6.6,25.27 3.68,28.2 J3.P$12
  Bottom 0.254: v19.56,20.07 v19.56,18.03
N$18
  Top 0.254: IC1.8 10.07,37.16 R47.2 R48.2
N$19
  Top 0.254: J3.P$13 3.69,22.61 14.22,22.61 15.24,21.59 16.76,21.59 18.92,19.43 R22.2
N$20
  Top 0.254: R38.1 33.36,9.03 U1.4
N$21
  Top 0.254: U$1.11 30.99,26.04 31.24,26.29 31.24,26.8 32,27.56 R28.2
N$22
  Top 0.254: 30.99,24 U$1.7 31.11,24 32.26,22.86 R26.2
N$23
  Top 0.254: U$1.10 31.5,25.53 31.75,25.78 31.75,26.29 32,26.54 35.05,26.54 35.05,26.5 R24.2
N$25
  Top 0.254: R34.1 14.48,6.64 U2.3
N$26
  Top 0.254: R35.1 11.81,8.45 U2.1
N$27
  Top 0.254: U$1.8 31.88,24.51 32.13,24.26 R25.2
N$28
  Top 0.254: U$1.5 29.46,22.39 29.34,22.26 R29.1
N$29  (via drill 0.3)
  Top 0.254: 7.28,38.23 C4.2 | IC1.6 7.7,39.58 v7.24,39.12 7.24,39.62 7.69,40.08 IC1.5 | R1.1 12.87,35.56 v13.84,35.56 14.99,36.7 20.57,36.7 20.99,37.12 R2.1 R3.1
  Top 0.305: v7.24,39.12 C4.2 5.97,38.27
  Top 0.61: 5.69,38.27 5.97,38.27 5.87,38.16 C5.2
  Bottom 0.254: v7.24,39.12 7.75,39.12 9.4,40.77 11.94,40.77 12.83,39.88 12.83,36.58 v13.84,35.56
N$30
  Top 0.254: U1.1 33.45,14.14 C20.2
N$31  (via drill 0.3)
  Top 0.254: C20.1 34.25,15.79 v34.29,15.75
  Bottom 0.254: v34.29,15.75 v38.61,15.75
  pour Top (no thermals): 38.23,12.45 47.5,12.45 47.5,16.51 38.23,16.51
N$32
  Top 0.254: 17.02,11.56 15.24,11.56 14.48,12.32 U2.6 | R37.2 17.02,12.92 17.02,11.56 | 17.02,11.56 20.19,11.56 21.84,9.91 30.35,9.91 30.86,10.41 33.42,10.41 U1.3
N$33
  Top 0.254: T3.1 50.73,33.38 R13.1
N$34
  pour Top (rank 2, no thermals): 55.75,12.19 58.29,12.19 58.55,11.94 58.55,8.13 58.67,8 61.34,8 61.34,13.34 59.69,14.73 59.69,15.24 57.91,15.24 57.53,14.86 57.53,13.59 57.4,13.46 55.75,13.46
N$35
  Top 0.254: U1.5 40.78,9.12 R40.1 41.15,10.03 41.27,10.16 41.66,10.16 41.91,10.41 42.29,10.41 42.42,10.54 42.42,10.96 R43.1 42.55,10.67 42.8,10.41 43.31,10.41 43.56,10.16 43.94,10.16 44.07,10.03 R39.2
N$36
  Top 0.254: R12.1 48.77,37.57 T2.1
N$37
  Top 0.254: ESP32.31 63.37,23.06 63.37,21.5 R10.2
N$38
  Top 0.254: ESP32.33 65.91,23.06 65.91,21.72 65.79,21.59 R44.2
N$39
  Top 0.254: IC3.3 55.08,17.46 55.08,17.91 R42.1 55.84,18.92 57.28,18.92 57.87,18.33 R41.2
N$40
  Top 0.254: ESP32.36 69.76,21.54 R45.2
N$41
  Top 0.254: IC1.20 11.57,43.58 11.68,43.69 13.34,43.69 15.11,41.91 R46.1
N$42
  Top 0.254: IC3.1 59.09,16.75 C23.2 60.34,16.52 61.21,17.4 61.21,18.69 D6.C
POE_RX
  Top 0.305: B1.AC2 10.11,14.18 13.46,17.53 13.46,18.91 J3.P$10
POE_SPARE  (via drill 0.3)
  Top 0.305: B2.AC1 v1.91,14.99
  Bottom 0.305: v1.91,14.99 1.91,18.8 5.71,22.61 15.78,22.61 J3.P$7
POE_TX  (via drill 0.3)
  Top 0.305: B1.AC1 7.7,14.18 v7.75,14.22
  Bottom 0.305: v7.75,14.22 10.16,14.22 13.46,17.53 14.48,17.53 16,19.05 16,20.18 J3.P$9
POE_VSS
  Top 0.254: R36.2 13.21,3.56 13.97,2.79 JP2.24
  Top 0.305: B2.- 4.45,9.02 5.08,9.65 9.02,9.65 9.65,9.02 B1.- 9.65,7.24 8.51,6.1 C18.1 6.73,6.01 | D3.A 7.89,4.05
  Top 0.61: 7.89,4.05 6.73,5.21 6.73,6.01 | 10.67,4.92 8.87,4.92 D3.A | U2.4 15.75,10.16 15.11,10.16 14.1,11.18 11.81,11.18 10.67,10.03 10.67,4.92 | 10.67,4.92 R35.2 R36.2
PWR-LED
  Top 0.254: PWR.A R4.2
RAW  (via drill 0.3)
  Top 0.254: R37.1 17.14,15.49 | R34.2 16.34,4.92 v16.51,5.08
  Top 0.305: B2.+ 1.91,6.86 2.67,6.1 C18.2 | C18.2 5.04,6.44 5.84,7.24 6.17,7.24 B1.+ | D3.C 3.79,4.05 | 4.95,6.01 C18.2 | U2.8 v11.94,12.57
  Top 0.61: 3.79,4.05 4.95,5.21 4.95,6.01 | v2.67,3.94 D3.C | U2.8 11.94,14.86 12.57,15.49 17.14,15.49 20.07,15.49 C19.+
  Top 1.016: C19.+ 23.73,11.84 C9.1 30.53,11.66 U1.2
  Bottom 0.61: v11.94,12.57 11.3,12.57 v2.67,3.94
  Bottom 1.016: JP2.23 v16.51,5.08 16.51,6.86 C19.+
RCLASS  (via drill 0.3)
  Top 0.254: U2.2 R36.1 v13.21,5.97
  Bottom 0.254: JP2.25 11.43,4.19 v13.21,5.97
RESET
  Top 0.254: IC1.9 10.57,38.2 10.79,37.97 12.7,37.97 12.83,37.85 R1.2
RTS  (via drill 0.3)
  Top 0.254: R14.2 21.84,41.02 22.99,42.16 31.11,42.16 34.42,38.86 42.8,38.86 v44.32,37.34 | R13.2 52.45,34.29 v52.32,34.42 52.51,34.6 T2.2
  Bottom 0.254: v52.32,34.42 51.94,34.8 49.4,34.8 48.13,36.07 48.13,38.99 47.62,39.5 46.86,39.5 44.7,37.34 v44.32,37.34
RX-LED
  Top 0.254: RX.A R2.2
RXD0  (via drill 0.3)
  Top 0.254: ESP32.34 67.31,23.01 67.31,20.19 69.34,18.16 v71.75,18.16 | R5.2 21.72,42.8 22.1,43.18 31.62,43.18 34.92,39.88 43.81,39.88 v44.32,39.37
  Bottom 0.254: JP2.3 67.31,3.56 68.45,3.56 71.75,6.86 v71.75,18.16 71.75,37.85 70.48,39.12 70.48,43.05 69.85,43.69 68.33,43.69 66.93,42.29 45.34,42.29 43.69,40.64 43.69,40.01 v44.32,39.37
RXLED
  Top 0.254: IC1.13 14.66,39.58 RX.C
SET_V++
  Top 0.254: JP2.13 41.91,8.85 R43.2
SVN  (via drill 0.3)
  Top 0.254: v67.31,39.75 67.31,41.01 ESP32.5
  Bottom 0.254: JP2.6 59.69,3.43 61.47,5.21 67.56,5.21 69.34,6.99 69.34,37.72 v67.31,39.75
SVP  (via drill 0.3)
  Top 0.254: v68.58,39.75 68.58,41.01 ESP32.4
  Bottom 0.254: JP2.5 62.23,3.43 63.5,4.7 67.94,4.7 70.61,7.37 70.61,37.08 68.58,39.12 v68.58,39.75
TX-LED
  Top 0.254: TX.A R3.2
TXD0  (via drill 0.3)
  Top 0.254: R46.2 21.59,41.91 22.35,42.67 31.37,42.67 34.67,39.37 43.31,39.37 v44.32,38.35 | ESP32.35 68.49,19.65 69.22,18.92 v72.39,18.92
  Bottom 0.254: v44.32,38.35 43.18,39.5 43.18,41.02 44.96,42.8 | 66.67,42.8 68.07,44.2 70.1,44.2 70.99,43.31 70.99,39.5 72.39,38.1 v72.39,18.92 72.39,6.73 69.85,4.19 JP2.2 | 66.67,42.8 44.96,42.8 | 66.67,42.8 44.96,42.8
TXLED
  Top 0.254: 15.94,39.95 TX.C 15.82,40.08 IC1.14
V++  (via drill 0.3)
  Top 0.254: 53.47,15.37 v53.59,15.24 | 44.11,11.05 R39.1 48.17,11.09 48.64,11.56 48.64,21.34
  Top 0.61: C21.1 v38.84,22.1 41.24,22.1 C26.+ 43.17,20.57 44.7,20.57 45.47,21.34 48.64,21.34 49.78,21.34 52.45,18.67 v52.45,18.03 | v53.59,15.24 C22.1 | JP2.12 44.45,4.45 47.5,7.49 52.96,7.49 v53.72,8.26 | v24.13,32.51 D1.C
  Bottom 0.61: v52.45,18.03 52.45,16.38 v53.59,15.24 53.72,15.11 v53.72,8.26 | v38.84,22.1 34.9,18.16 25.78,18.16 22.86,21.08 22.86,31.24 v24.13,32.51
  pour Top (rank 2, no thermals): 38.23,20.45 39.62,20.45 40.77,19.3 47.5,19.3 47.5,17.02 38.23,17.02
  pour Top (no thermals): 52.32,14.99 56.64,14.99 56.9,14.73 56.9,14.22 56.77,14.1 55.5,14.1 55.12,13.72 52.32,13.72
YELLOW
  Top 0.254: R22.1 23.5,19.43 24.89,18.03 27.69,18.03 28.45,18.8 28.45,19.3 27.94,19.81 U$1.2

### Text on the board
tPlace: POESP-board | Aart 02-2018 | 1.1
bPlace: RAW | R_CLASS | POE_VSS | 15 | 2 | 13 | 12 | 14 | 5 | 16 | 4 | GND | SET_V++ | V++ | 3V3 | 33 | 32 | 35 | 34 | SVN | SVP | EN | RXD0 | TXD0 | GND